# Altium schematic sheet 30to50V-24V_10A_3.SchDoc
size 279 x 215 mm; SheetNumber: 3; SheetTotal: 3
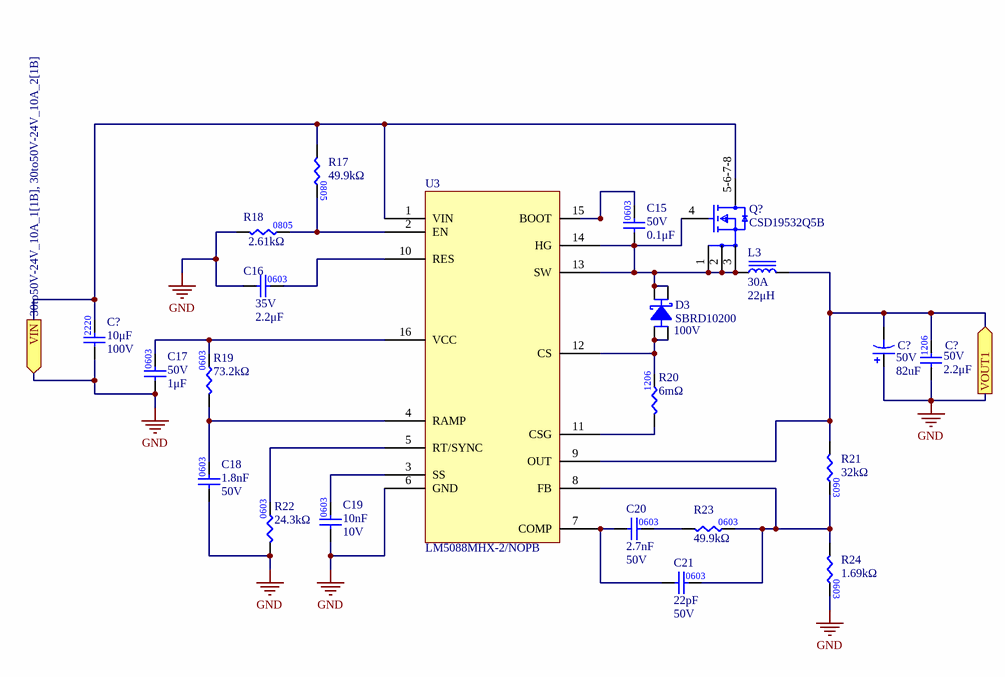
[diagram p0: 30to50V-24V_10A_3.SchDoc]

## Parts
(Parts that share a designator on the sheet are numbered #1, #2 ... from top to bottom, then left to right.)
C15  value 0.1μF  Voltage Rating: 50V  [CAP0603]  (hidden comment: CAP_0.1uF_50V_0603)
C16  value 2.2μF  Voltage Rating: 35V  [CAP0603]  (hidden comment: CAP_2.2uF_35V_0603)
C17  value 1μF  Voltage Rating: 50V  [CAP0603]  (hidden comment: CAP_1uF_50V_0603)
C18  value 1.8nF  Voltage Rating: 50V  [CAP0603]  (hidden comment: CAP_1.8nF_50V_0603)
C19  value 10nF  Voltage Rating: 10V  [CAP0603]  (hidden comment: CAP_10nF_25V_0603)
C20  value 2.7nF  Voltage Rating: 50V  [CAP0603]  (hidden comment: CAP_2.7nF_50V_0603)
C21  value 22pF  Voltage Rating: 50V  [CAP0603]  (hidden comment: CAP_22pF_50V_0603)
C?#1  value 10μF  Voltage Rating: 100V  [C5750X7S2A106M230KB]  (hidden comment: CAP_10uF_50V_2220)
C?#2  Voltage Rating: 50V  Capacitance: 82uF  [RADIAL_CORNELL_D]  (hidden comment: CAP_47uF_100V_ALUM)
C?#3  value 2.2μF  Voltage Rating: 50V  [CAP1206]  (hidden comment: CAP_2.2uF_50V_1206)
D3  Manufacturer Part Number 1: SBRD10200  Vr (Max): 100V  [D-PAK]  (hidden comment: DIO_SCHOTTKY_100V_5.5A)
L3  Current Rating: 30A  Inductance: 22μH  [IND_VISHAY_IHLP6767GZ51]  (hidden comment: IND_22uH_30A)
Q?  CSD19532Q5B  [FP-DNK0008A-MFG]
R17  value 49.9kΩ  [RES0805]  (hidden comment: RES_49.9kΩ_0805_1%)
R18  value 2.61kΩ  [RES0805]  (hidden comment: RES_2.61kΩ_0805_1%)
R19  value 73.2kΩ  [RES0603]  (hidden comment: RES_73.2kΩ_0603_1%)
R20  value 6mΩ  [RES1206]  (hidden comment: RES_0.006Ω_1206_1%)
R21  value 32kΩ  [RES0603]  (hidden comment: RES_32KΩ_0603_0.1%)
R22  value 24.3kΩ  [RES0603]  (hidden comment: RES_24.3kΩ_0603_1%)
R23  value 49.9kΩ  [RES0603]  (hidden comment: RES_49.9kΩ_0603_1%)
R24  value 1.69kΩ  [RES0603]  (hidden comment: RES_1.69kΩ_0603_1%)
U3  LM5088  (value not drawn)

## Ports
VIN (in, see 30to50V-24V_10A_1[1B], 30to50V-24V_10A_2[1B]), VOUT1 (out)

## Nets
GND: C16.1 C17.1 C18.1 C19.1 C?#1.1 C?#1.2 C?#2.1 C?#2.2 C?#3.1 C?#3.2 L3.2 Q?.5-6-7-8(D) R17.1 R18.1 R21.1 R22.1 R24.2 U3.1(VIN) U3.6(GND) U3.9(OUT) ; port VIN, port VOUT1
NetC15_1: C15.1 D3.2(Cathode) D3.4(Cathode) L3.1 Q?.1(S) Q?.2(S) Q?.3(S) Q?.4(G) U3.13(SW) U3.14(HG)
NetC15_2: C15.2 U3.15(BOOT)
NetC16_2: C16.2 U3.10(RES)
NetC17_2: C17.2 R19.2 U3.16(VCC)
NetC18_2: C18.2 R19.1 U3.4(RAMP)
NetC19_2: C19.2 U3.3(SS)
NetC20_1: C20.1 C21.1 U3.7(COMP)
NetC20_2: C20.2 R23.1
NetC21_2: C21.2 R21.2 R23.2 R24.1 U3.8(FB)
NetD3_1: D3.1(Anode) D3.3(Anode) R20.2 U3.12(CS)
NetR17_2: R17.2 R18.2 U3.2(EN)
NetR20_1: R20.1 U3.11(CSG)
NetR22_2: R22.2 U3.5(RT/SYNC)

## Notes on the sheet
- University of Waterloo Robotics Team
- 200 University Ave W
- REV
- PROJECT
- Waterloo, Ontario, Canada
- N2L 3G1
- DOCUMENT
- ENGINEER
- REVIEWER
- MODIFIED
- SHEET
- OF
- (in symbol CAP_1.8nF_50V_0603) 0603
- (in symbol CAP_1uF_50V_0603) 0603
- (in symbol CAP_2.2uF_35V_0603) 0603
- (in symbol CAP_2.2uF_50V_1206) 1206
- (in symbol CAP_2.7nF_50V_0603) 0603
- (in symbol CAP_10nF_25V_0603) 0603
- (in symbol CAP_10uF_50V_2220) 2220
- (in symbol CAP_22pF_50V_0603) 0603
- (in symbol RES_1.69kΩ_0603_1%) 0603
- (in symbol RES_49.9kΩ_0603_1%) 0603

## Library data of the parts
C15 = CAP_0.1uF_50V_0603: CAP CER 0.1UF 50V X7R 0603; Manufacturer Part Number 1: CC0603KRX7R9BB104; Manufacturer 1: Yageo; Package/Footprint: 0603; Supplier Part Number 1: 311-1344-1-ND; Supplier 1: Digi-Key; Mounting Type: SMD; Dielectric: X7R
C16 = CAP_2.2uF_35V_0603: CAP CER 2.2UF 35V X5R 0603; Manufacturer Part Number 1: C1608X5R1V225K080AC; Manufacturer 1: TDK Corporation; Dielectric: 5; Supplier Part Number 1: 445-8025-1-ND; Supplier 1: Digi-Key
C17 = CAP_1uF_50V_0603: CAP CER 1UF 50V X6S 0603; Manufacturer Part Number 1: C1608X6S1H105K080AC; Manufacturer 1: TDK Corporation; Supplier Part Number 1: 445-7424-1-ND; Supplier 1: Digi-Key; Dielectric: X6S
C18 = CAP_1.8nF_50V_0603: CAP CER 1800PF 50V C0G/NP0 0603; Manufacturer Part Number 1: GRM1885C1H182JA01J; Manufacturer 1: Murata Electronics; Dielectric: C0G; Supplier Part Number 1: 490-6380-1-ND; Supplier 1: Digi-Key
C19 = CAP_10nF_25V_0603: CAP CER 10000PF 25V C0G 0603; Manufacturer Part Number 1: C1608C0G1E103J080AA; Manufacturer 1: Yageo; Supplier Part Number 1: 445-2664-1-ND; Supplier 1: Digi-Key; Dielectric: C0G
C20 = CAP_2.7nF_50V_0603: CAP CER 2700PF 50V X7R 0603; Manufacturer Part Number 1: GRM1885C1H272JA01D; Manufacturer 1: Murata Electronics; Dielectric: C0G; Supplier Part Number 1: 490-3283-1-ND; Supplier 1: Digi-Key
C21 = CAP_22pF_50V_0603: CAP CER 22PF 50V C0G/NPO 0603; Manufacturer Part Number 1: CC0603JRNPO9BN220; Manufacturer 1: Yageo; Dielectric: C0G; Supplier Part Number 1: 311-1062-1-ND; Supplier 1: Digi-Key
C?#1 = CAP_10uF_50V_2220: CAP CER 10UF 100V X7S 2220; Manufacturer 1: TDK Corporation; Dielectric: X7R; Supplier 1: Digi-Key; Supplier Part Number 1: 445-5212-1-ND; Manufacturer Part Number 1: C5750X7S2A106M230KB
C?#2 = CAP_47uF_100V_ALUM: Aluminum Electrolytic Capacitor, Polarized, Aluminum (wet), 100V, 20% +Tol, 20% -Tol, 47uF, Surface Mount, 5454; Manufacturer: Nichicon; Manufacturer Part Number: UCD2A470MNQ1MS; Dielectric Material: Aluminium; Leakage Current: 47uA; Ripple Current: 250mA; Tan Delta: 0.07; ComponentLink1URL: https://datasheet.ciiva.com:443/pdfs/VipMasterIC/IC/NICH/NICH-S-A0003527725/NICH-S-A0003527725-1.pdf?src-supplier=IHS+Markit; ComponentLink1Description: https://datasheet.ciiva.com:443/pdfs/VipMasterIC/IC/NICH/NICH-S-A0003527725/NICH-S-A0003527725-1.pdf?src-supplier=IHS+Markit; ComponentLink2URL: https://datasheet.ciiva.com/11776/0900766b80ebdadd-11776792.pdf?src-supplier=RSComponents; ComponentLink2Description: https://datasheet.ciiva.com/11776/0900766b80ebdadd-11776792.pdf?src-supplier=RSComponents; ComponentLink3URL: https://datasheet.ciiva.com/30526/getdatasheetpartid-513218-30526979.pdf?src-supplier=Verical; ComponentLink3Description: https://datasheet.ciiva.com/30526/getdatasheetpartid-513218-30526979.pdf?src-supplier=Verical; ComponentLink4URL: https://datasheet.ciiva.com/16389/e-cd-16389182.pdf?src-supplier=Future+Electronics; ComponentLink4Description: https://datasheet.ciiva.com/16389/e-cd-16389182.pdf?src-supplier=Future+Electronics; ComponentLink5URL: https://datasheet.ciiva.com/17523/e-cd-17523974.pdf?src-supplier=Avnet+Europe; ComponentLink5Description: https://datasheet.ciiva.com/17523/e-cd-17523974.pdf?src-supplier=Avnet+Europe; ComponentLink6URL: https://datasheet.ciiva.com/6326/e-cd-6326630.pdf?src-supplier=Digi-Key; ComponentLink6Description: https://datasheet.ciiva.com/6326/e-cd-6326630.pdf?src-supplier=Digi-Key; ComponentLink7URL: https://datasheet.ciiva.com/6326/e-cd-6326632.pdf?src-supplier=Digi-Key; ComponentLink7Description: https://datasheet.ciiva.com/6326/e-cd-6326632.pdf?src-supplier=Digi-Key; ComponentLink8URL: https://datasheet.ciiva.com/6326/e-cd-6326634.pdf?src-supplier=Digi-Key; ComponentLink8Description: https://datasheet.ciiva.com/6326/e-cd-6326634.pdf?src-supplier=Digi-Key; Supplier 1: Digi-Key; RoHS: Yes; Category: Aluminum Electrolytic Capacitors; Stock 1: 515; Pricing 1: 1=2.15000, 10=1.69800, 50=1.47140, 100=1.27330 (USD); Mount: Surface Mount; Number of Pins: 2; Package Shape: Cylindrical; Size Code: 7575; Terminal Finish: Copper; Min Operating Temperature: -55°C; Max Operating Temperature: 105°C; JESD-609 Code: e3; Polarity: Polarized; Capacitor Type: Aluminium; Negative Tolerance: 20%; Package Style: SMTMeter; Packaging: Tape and Reel; Positive Tolerance: 20%; Rated DC Voltage (URdc): 100V; Termination: Flat; Length: 14.6mm; Width: 13.6mm; Height: 13.5mm; REACH SVHC: Yes; RoHS Compliant: Yes; Supplier Part Number 1: 493-6201-1-ND
C?#3 = CAP_2.2uF_50V_1206: CAP CER 2.2UF 50V X7R 1206; Manufacturer 1: Murata Electronics; Manufacturer Part Number 1: GCM31CR71H225KA55L; Supplier Part Number 1: 490-4796-1-ND; Supplier 1: Digi-Key; Dielectric: X7R
D3 = DIO_SCHOTTKY_200V_10A: DIODE SCHOTTKY 200V 10A DPAK; Manufacturer 1: SMC Diode Solutions; Package/Footprint: TO-252-3, DPak (2 Leads + Tab), SC-63; Supplier 1: Digi-Key; Supplier Part Number 1: 1655-SBRD10200CT-ND; Mounting Type: SMD
L3 = IND_22uH_30A: FIXED IND 22UH 30A 2.4 MOHM SMD; Manufacturer 1: Würth Elektronik; Manufacturer Part Number 1: 7443642200; DC Resistance (DCR): 2.4mR; Inductance Tolerance: 15%; Saturation Current: 30A; Supplier 1: Digi-Key; Supplier Part Number 1: 732-5628-ND; Mounting Type: SMD
Q? = CMP-04962-000007-1: MOSFET N-CH 100V 100A 8SON; Manufacturer: Texas Instruments; Depletion Mode: False; Number Of Channels: 1; Gate To Source Voltage: 20V; Reverse Recovery Time: 80ns; Input Capacitace At Vds: 3700pF @ 50V; Max Forward Diode Voltage: 1V; Turn Off Delay Time: 22ns; Drain To Source Resistance: 4.6mΩ; Threshold Vgs Max: 3.2V; Max Junction Temp: +150°C; Turn On Delay Time: 7ns; Pulse Drain Current: 400A; Rthja Max: 50°C/W; Typ Forward Diode Voltage: 0.8V; Reverse Recovery Charge: 249nC; Threshold Vgs Min: 2.2V; Gate Charge At Vgs: 48nC @ 10V; Power Dissipation: 3.1W; Transconductance: 84S; Temperature Range Low: -55°C; Automotive: No; RoHS: TRUE; Temperature: -55°C to +150°C; Device Class L3: MOSFETs; Continuous Drain Current: 100A; Number Of N Channels: 1; Height: 1.05mm; Mouser Description: MOSFET 100V 4.0 mOhm N-Ch NexFET Power MOSFET; Drain To Source Voltage: 100V; Temperature Range High: +150°C; Manufacturer Part Number: CSD19532Q5B; Octopart: https://octopart.com/csd19532q5b-texas+instruments-32890191; ComponentLink2URL: http://www.ti.com/lit/ds/symlink/csd19532q5b.pdf; Lead Free: Yes; Drain To Source Breakdown Voltage: 100V; Device Class L1: Discrete Semiconductors; Device Class L2: Transistors; Package: DNK0008A; Digikey Description: MOSFET N-CH 100V 100A 8SON; Category: Trans; ComponentLink2Description: Datasheet
R17 = RES_49.9kΩ_0805_1%: RES 49.9K OHM 1% 1/8W 0805; Manufacturer 1: Vishay Dale; Manufacturer Part Number 1: TNPW080549K9BEEN; Package/Footprint: 0805; Supplier 1: Digi-Key; Mounting Type: SMD; Supplier Part Number 1: 541-3802-1-ND; LCSC Part #: C17719
R18 = RES_2.61kΩ_0805_1%: RES 2.61K OHM 1% 1/8W 0805; Manufacturer 1: Vishay Dale; Manufacturer Part Number 1: RC0805FR-072K61L; Package/Footprint: 0805; Supplier 1: Digi-Key; Mounting Type: SMD; Supplier Part Number 1: 311-2.61KCRCT-ND
R19 = RES_73.2kΩ_0603_1%: RES 73.2K OHM 1% 1/10W 0603; Manufacturer 1: YAGEO; Manufacturer Part Number 1: RC0603FR-0773K2L; Power: 0.1W; Supplier Part Number 1: 311-73.2KHRCT-ND; Supplier 1: Digi-Key; Package: 0603; Tolerance: 1%
R20 = RES_0.006Ω_1206_1%: RES 0.006 OHM 1% 1W 1206; Manufacturer 1: Rohm Semiconductor; Package/Footprint: 1206; Manufacturer Part Number 1: Rohm Semiconductor; Mounting Type: SMD; Supplier 1: Digi-Key; Supplier Part Number 1: RHM.006ALCT-ND
R21 = RES_32KΩ_0603_0.1%: RES SMD 32K OHM 0.1% 1/10W 0603; Manufacturer 1: Yageo; Manufacturer Part Number 1: RT0603BRD0732KL; Supplier Part Number 1: 13-RT0603BRD0732KLCT-ND; Supplier 1: Digi-Key; Mounting Type: SMD; Package: 0603
R22 = RES_24.3kΩ_0603_1%: RES 24.3K OHM 1% 1/10W 0603; Manufacturer 1: YAGEO; Manufacturer Part Number 1: RC0603FR-0724K3L; Power: 0.1W; Supplier Part Number 1: 311-24.3KHRCT-ND; Supplier 1: Digi-Key; Package: 0603; Tolerance: 1%
R23 = RES_49.9kΩ_0603_1%: RES 49.9K OHM 1% 1/10W 0603; Manufacturer Part Number 1: RK73H1JTTD4992F; Manufacturer 1: KOA Speer Electronics, Inc.; Supplier 1: Digi-Key; Supplier Part Number 1: 2019-RK73H1JTTD4992FCT-ND; Mounting Type: SMD
R24 = RES_1.69kΩ_0603_1%: RES 1.69K OHM 1% 1/10W 0603; Manufacturer 1: Yageo; Manufacturer Part Number 1: RC0603FR-071K69L; Supplier 1: Digi-Key; Supplier Part Number 1: 311-1.69KHRCT-ND
U3 = LM5088MHX-2/NOPB: IC REG CTRLR BUCK 16HTSSOP; Manufacturer 1: Texas Instruments; Supply Voltage: 4.5V - 75V; Switching Frequency: 50kHz - 1MHz; Supplier 1: Digi-Key; Supplier Part Number 1: 296-35302-1-ND; Package: 16-HTSSOP; Manufacturer Part Number 1: LM5088MHX-2/NOPB